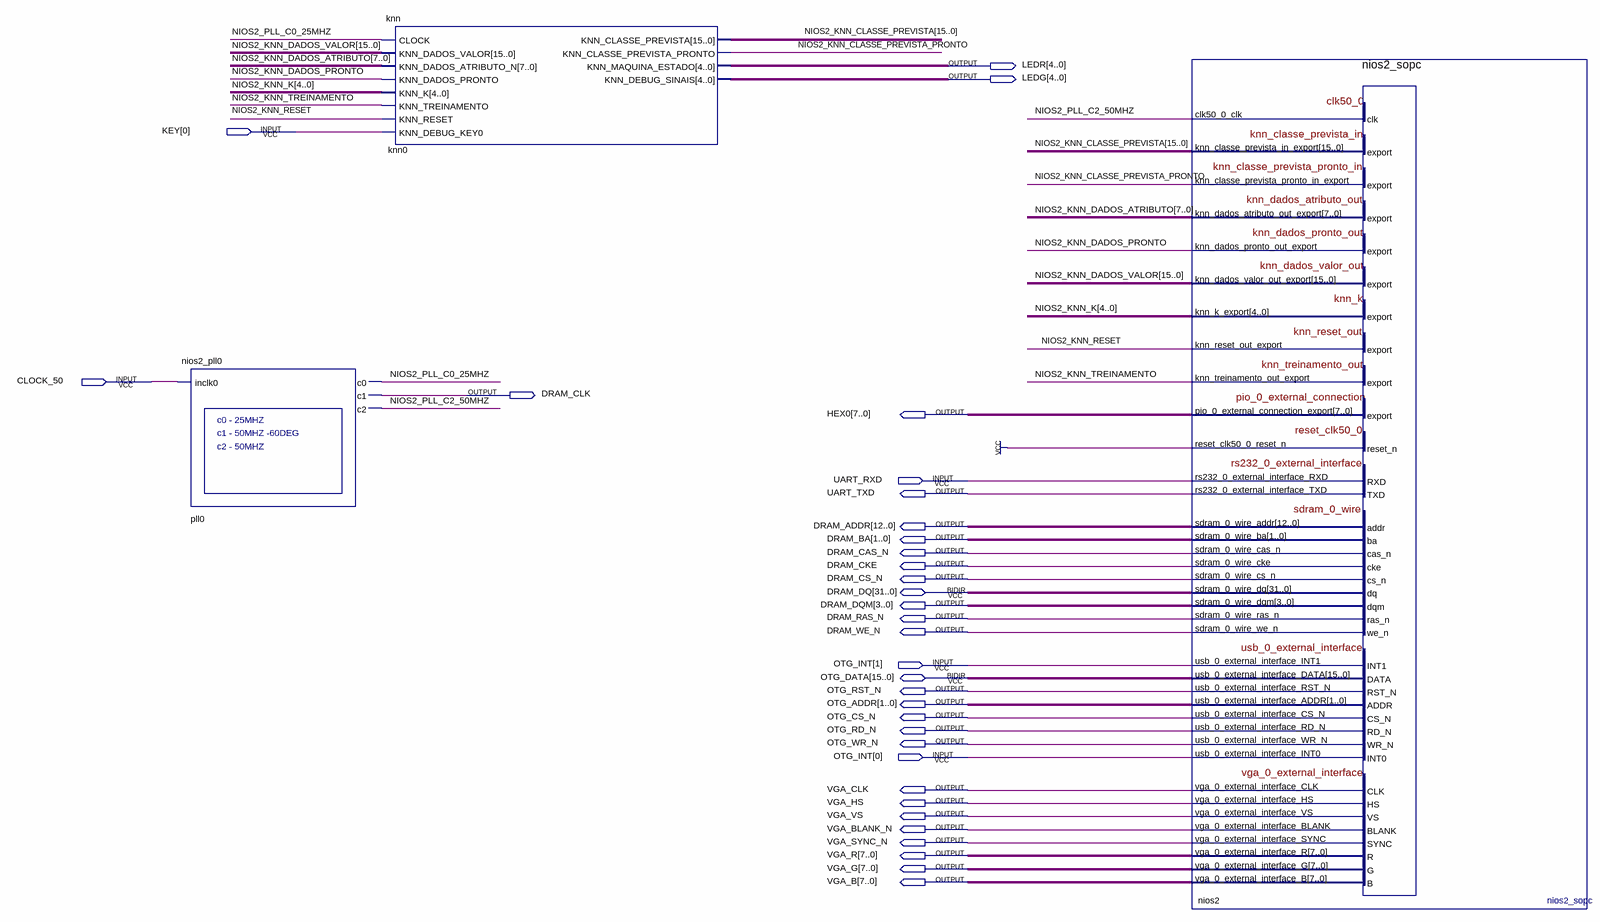
[diagram p0: schematic sheet]
// Quartus schematic KNN_NIOS2.bdf as structural Verilog: 3 symbols, 33 pins
module KNN_NIOS2 (
  input  [0:0] KEY,
  input  CLOCK_50,
  input  UART_RXD,
  input  [1:0] OTG_INT,
  inout  [31:0] DRAM_DQ,
  inout  [15:0] OTG_DATA,
  output [4:0] LEDR,
  output [4:0] LEDG,
  output DRAM_CLK,
  output [7:0] HEX0,
  output UART_TXD,
  output [12:0] DRAM_ADDR,
  output [1:0] DRAM_BA,
  output DRAM_CAS_N,
  output DRAM_CKE,
  output DRAM_CS_N,
  output [3:0] DRAM_DQM,
  output DRAM_RAS_N,
  output DRAM_WE_N,
  output OTG_RST_N,
  output [1:0] OTG_ADDR,
  output OTG_CS_N,
  output OTG_RD_N,
  output OTG_WR_N,
  output VGA_CLK,
  output VGA_HS,
  output VGA_VS,
  output VGA_BLANK_N,
  output VGA_SYNC_N,
  output [7:0] VGA_R,
  output [7:0] VGA_G,
  output [7:0] VGA_B
);

  wire NIOS2_KNN_CLASSE_PREVISTA_PRONTO, NIOS2_KNN_DADOS_PRONTO, NIOS2_KNN_RESET, NIOS2_KNN_TREINAMENTO,
       NIOS2_PLL_C0_25MHZ, NIOS2_PLL_C2_50MHZ;
  wire [4:0] NIOS2_KNN_K;
  wire [7:0] NIOS2_KNN_DADOS_ATRIBUTO;
  wire [15:0] NIOS2_KNN_CLASSE_PREVISTA, NIOS2_KNN_DADOS_VALOR;

  nios2_pll0 pll0 (.inclk0(CLOCK_50), .c0(NIOS2_PLL_C0_25MHZ), .c1(DRAM_CLK), .c2(NIOS2_PLL_C2_50MHZ));
  knn knn0 (
    .CLOCK(NIOS2_PLL_C0_25MHZ), .KNN_DADOS_VALOR(NIOS2_KNN_DADOS_VALOR),
    .KNN_DADOS_ATRIBUTO_N(NIOS2_KNN_DADOS_ATRIBUTO), .KNN_DADOS_PRONTO(NIOS2_KNN_DADOS_PRONTO),
    .KNN_K(NIOS2_KNN_K), .KNN_TREINAMENTO(NIOS2_KNN_TREINAMENTO), .KNN_RESET(NIOS2_KNN_RESET),
    .KNN_DEBUG_KEY0(KEY[0]), .KNN_CLASSE_PREVISTA(NIOS2_KNN_CLASSE_PREVISTA),
    .KNN_CLASSE_PREVISTA_PRONTO(NIOS2_KNN_CLASSE_PREVISTA_PRONTO), .KNN_MAQUINA_ESTADO(LEDR),
    .KNN_DEBUG_SINAIS(LEDG));
  nios2_sopc nios2 (
    .clk50_0_clk(NIOS2_PLL_C2_50MHZ), .knn_classe_prevista_in_export(NIOS2_KNN_CLASSE_PREVISTA),
    .knn_classe_prevista_pronto_in_export(NIOS2_KNN_CLASSE_PREVISTA_PRONTO), .reset_clk50_0_reset_n(1'b1),
    .rs232_0_external_interface_RXD(UART_RXD), .usb_0_external_interface_INT1(OTG_INT[1]),
    .usb_0_external_interface_INT0(OTG_INT[0]), .knn_dados_atributo_out_export(NIOS2_KNN_DADOS_ATRIBUTO),
    .knn_dados_pronto_out_export(NIOS2_KNN_DADOS_PRONTO), .knn_dados_valor_out_export(NIOS2_KNN_DADOS_VALOR),
    .knn_k_export(NIOS2_KNN_K), .knn_reset_out_export(NIOS2_KNN_RESET),
    .knn_treinamento_out_export(NIOS2_KNN_TREINAMENTO), .pio_0_external_connection_export(HEX0),
    .rs232_0_external_interface_TXD(UART_TXD), .sdram_0_wire_addr(DRAM_ADDR), .sdram_0_wire_ba(DRAM_BA),
    .sdram_0_wire_cas_n(DRAM_CAS_N), .sdram_0_wire_cke(DRAM_CKE), .sdram_0_wire_cs_n(DRAM_CS_N),
    .sdram_0_wire_dqm(DRAM_DQM), .sdram_0_wire_ras_n(DRAM_RAS_N), .sdram_0_wire_we_n(DRAM_WE_N),
    .usb_0_external_interface_RST_N(OTG_RST_N), .usb_0_external_interface_ADDR(OTG_ADDR),
    .usb_0_external_interface_CS_N(OTG_CS_N), .usb_0_external_interface_RD_N(OTG_RD_N),
    .usb_0_external_interface_WR_N(OTG_WR_N), .vga_0_external_interface_CLK(VGA_CLK),
    .vga_0_external_interface_HS(VGA_HS), .vga_0_external_interface_VS(VGA_VS),
    .vga_0_external_interface_BLANK(VGA_BLANK_N), .vga_0_external_interface_SYNC(VGA_SYNC_N),
    .vga_0_external_interface_R(VGA_R), .vga_0_external_interface_G(VGA_G),
    .vga_0_external_interface_B(VGA_B), .sdram_0_wire_dq(DRAM_DQ), .usb_0_external_interface_DATA(OTG_DATA));
endmodule
